# EAGLE design sensor-board (EAGLE 6.4)
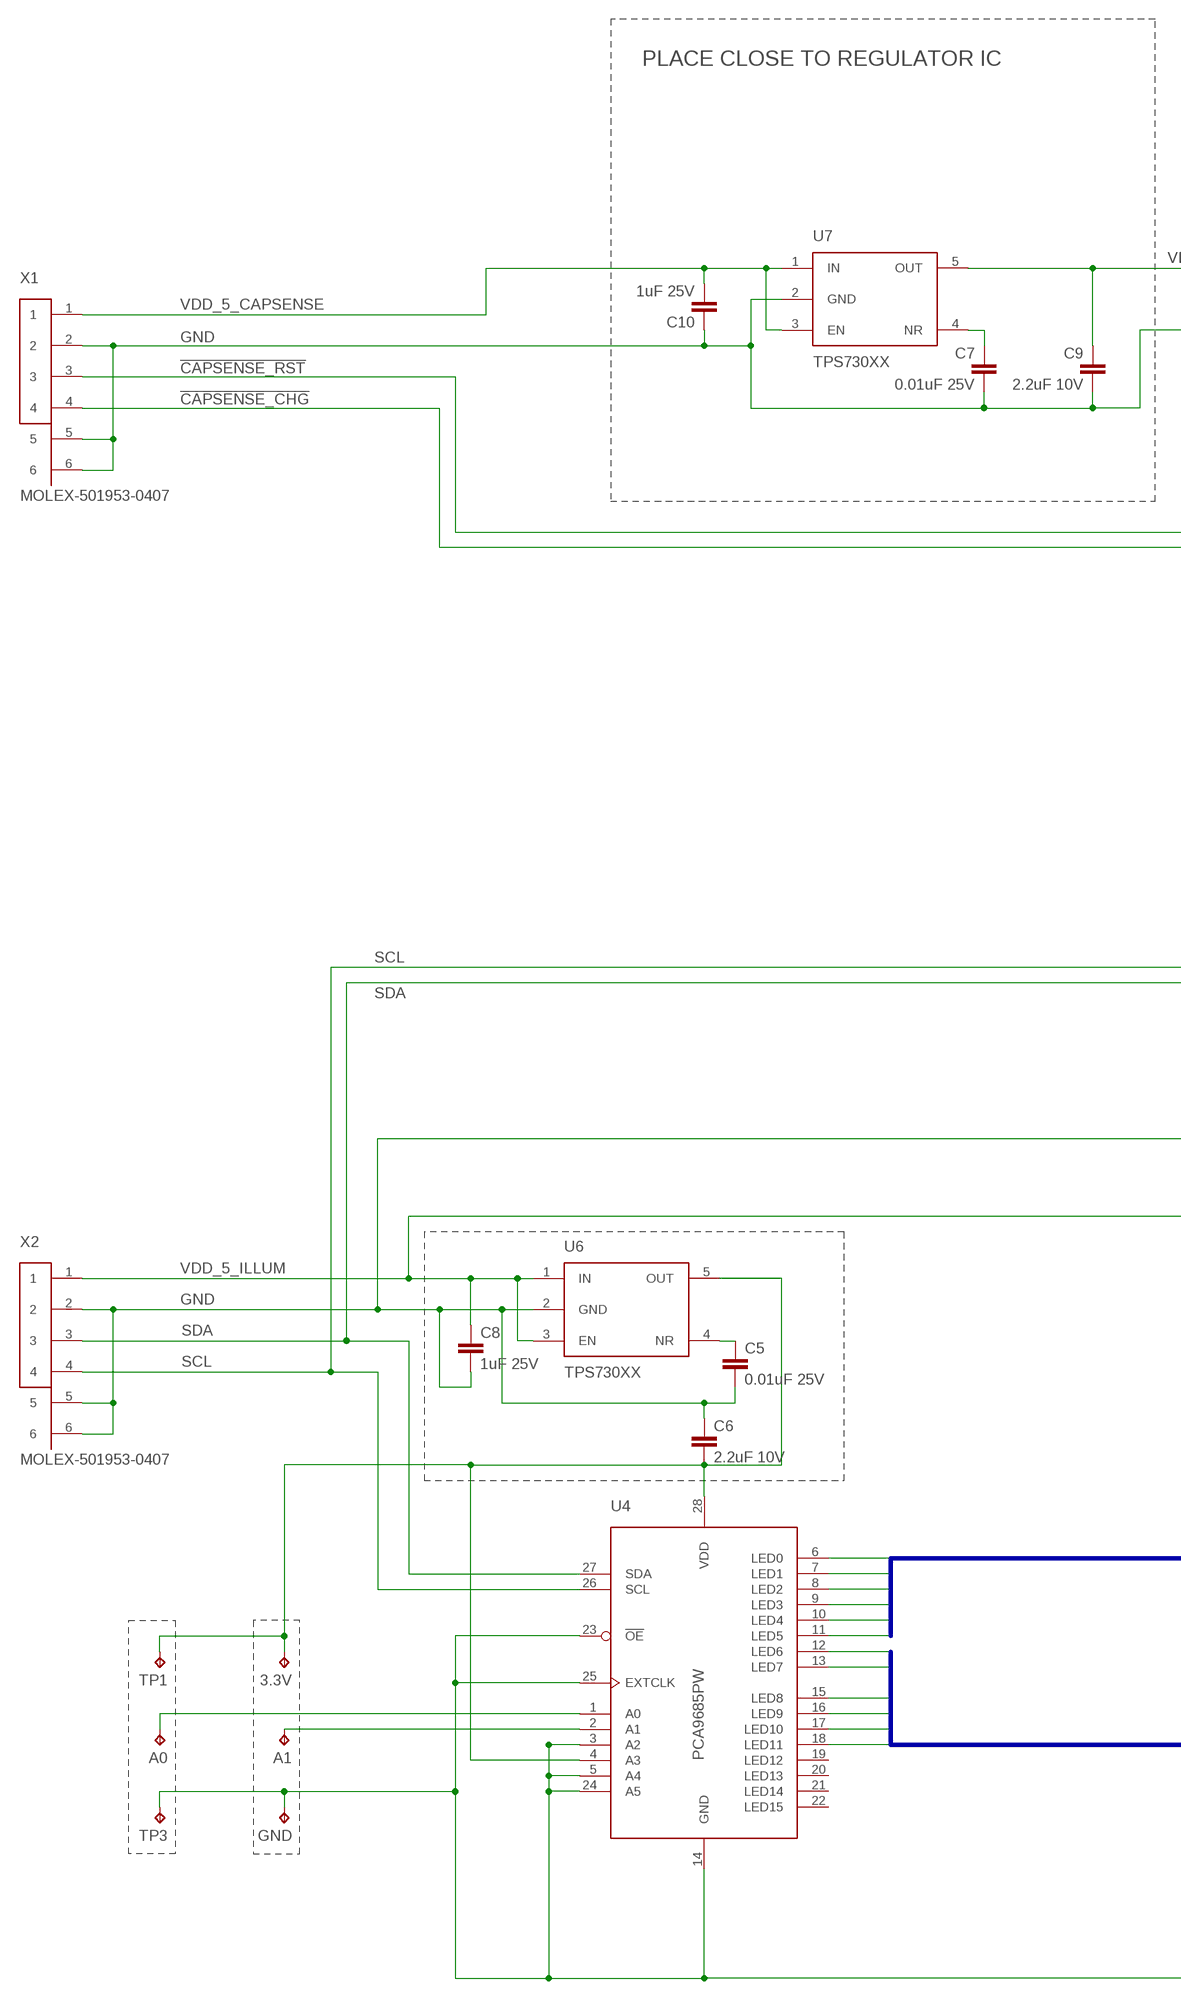
[diagram p0: schematic, sheet 1, part 1 of 2]
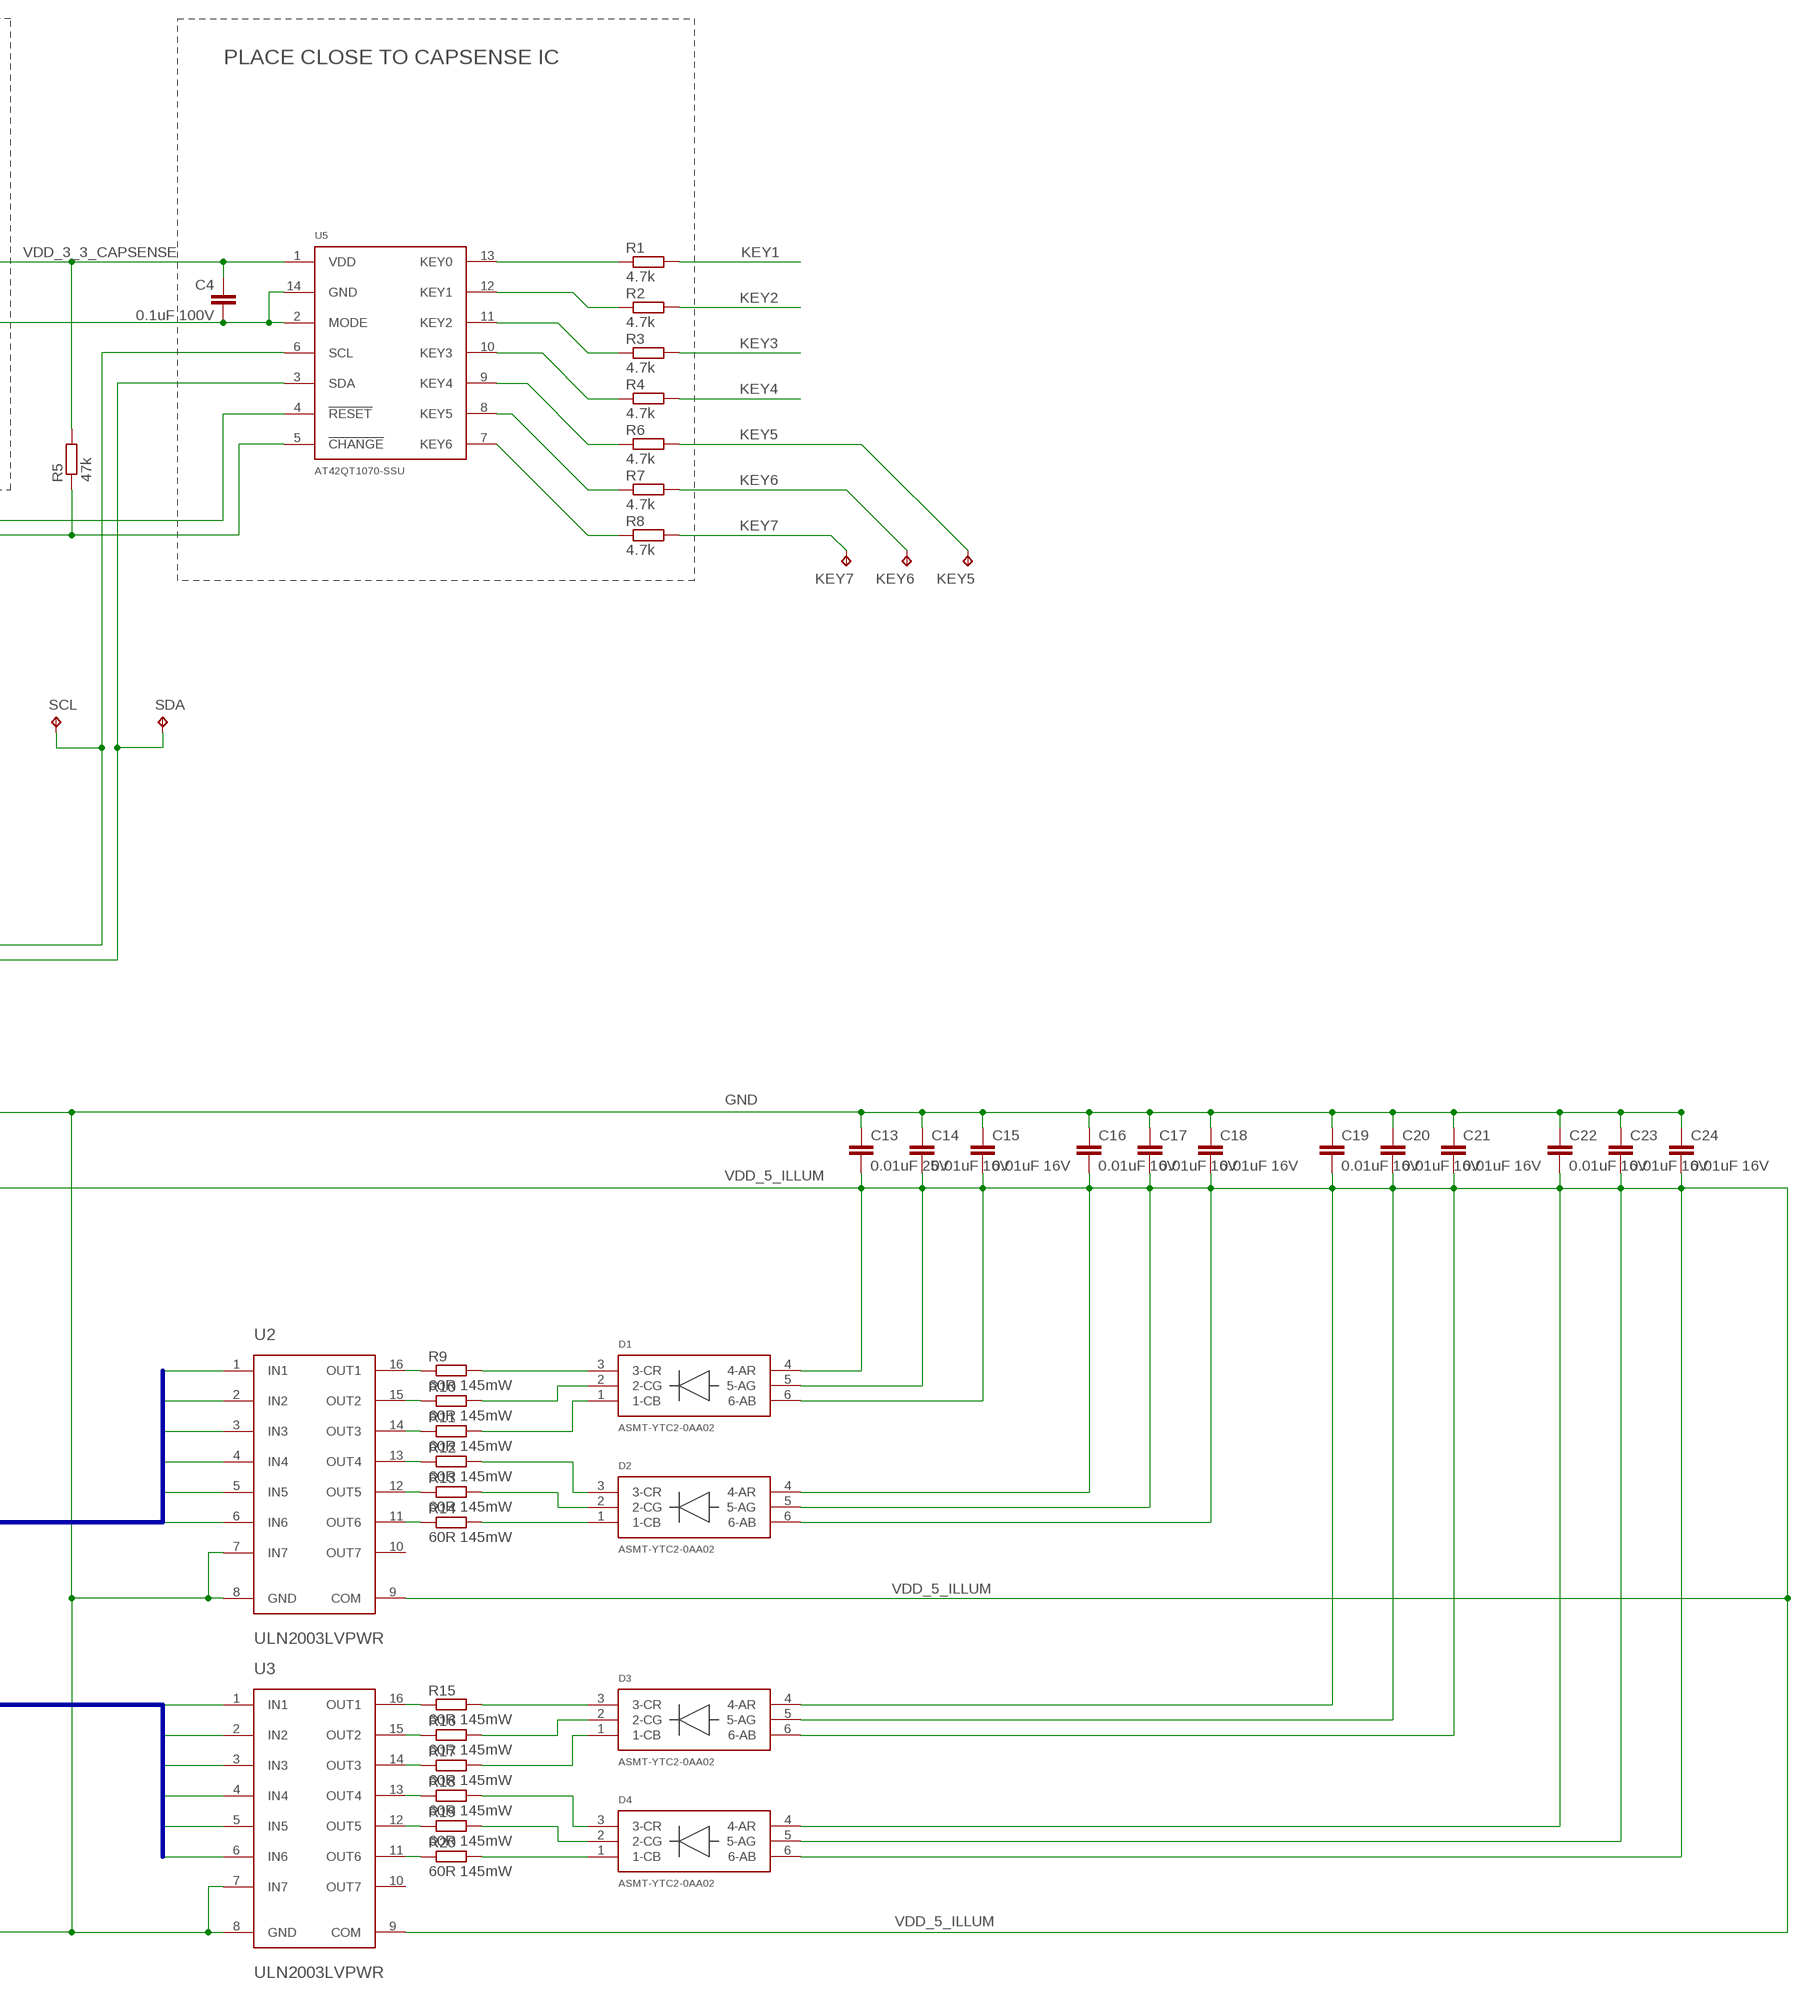
[diagram p1: schematic, sheet 1, part 2 of 2]

## Parts
3.3V  TPB1,27  [B1,27]
A0  TPB1,27  [B1,27]
A1  TPB1,27  [B1,27]
C4  0.1uF 100V  C-EUC0402K  [C0402K]
C5  0.01uF 25V  C-EUC0402K  [C0402K]
C6  2.2uF 10V  C-EUC0402K  [C0402K]
C7  0.01uF 25V  C-EUC0402K  [C0402K]
C8  1uF 25V  C-EUC0402K  [C0402K]
C9  2.2uF 10V  C-EUC0402K  [C0402K]
C10  1uF 25V  C-EUC0402K  [C0402K]
C13  0.01uF 25V  C-EUC0402K  [C0402K]
C14  0.01uF 16V  C-EUC0402K  [C0402K]
C15  0.01uF 16V  C-EUC0402K  [C0402K]
C16  0.01uF 16V  C-EUC0402K  [C0402K]
C17  0.01uF 16V  C-EUC0402K  [C0402K]
C18  0.01uF 16V  C-EUC0402K  [C0402K]
C19  0.01uF 16V  C-EUC0402K  [C0402K]
C20  0.01uF 16V  C-EUC0402K  [C0402K]
C21  0.01uF 16V  C-EUC0402K  [C0402K]
C22  0.01uF 16V  C-EUC0402K  [C0402K]
C23  0.01uF 16V  C-EUC0402K  [C0402K]
C24  0.01uF 16V  C-EUC0402K  [C0402K]
D1  ASMT-YTC2-0AA02  [ASMT-YTC2-0AA02-REV]
D2  ASMT-YTC2-0AA02  [ASMT-YTC2-0AA02-REV]
D3  ASMT-YTC2-0AA02  [ASMT-YTC2-0AA02-REV]
D4  ASMT-YTC2-0AA02  [ASMT-YTC2-0AA02-REV]
GND  TPB1,27  [B1,27]
KEY5  TPTP06R  [TP06R]
KEY6  TPTP06R  [TP06R]
KEY7  TPTP06R  [TP06R]
R1  4.7k  R-EU_NKR0402  [R0402]
R2  4.7k  R-EU_NKR0402  [R0402]
R3  4.7k  R-EU_NKR0402  [R0402]
R4  4.7k  R-EU_NKR0402  [R0402]
R5  47k  R-EU_NKR0402  [R0402]
R6  4.7k  R-EU_NKR0402  [R0402]
R7  4.7k  R-EU_NKR0402  [R0402]
R8  4.7k  R-EU_NKR0402  [R0402]
R9  60R 145mW  R-EU_NKR0603  [R0603]
R10  60R 145mW  R-EU_NKR0603  [R0603]
R11  60R 145mW  R-EU_NKR0603  [R0603]
R12  60R 145mW  R-EU_NKR0603  [R0603]
R13  60R 145mW  R-EU_NKR0603  [R0603]
R14  60R 145mW  R-EU_NKR0603  [R0603]
R15  60R 145mW  R-EU_NKR0603  [R0603]
R16  60R 145mW  R-EU_NKR0603  [R0603]
R17  60R 145mW  R-EU_NKR0603  [R0603]
R18  60R 145mW  R-EU_NKR0603  [R0603]
R19  60R 145mW  R-EU_NKR0603  [R0603]
R20  60R 145mW  R-EU_NKR0603  [R0603]
SCL  TPTP06R  [TP06R]
SDA  TPTP06R  [TP06R]
TP1  TPB1,27  [B1,27]
TP3  TPB1,27  [B1,27]
U2  ULN2003LVPWR  [TSSOP-PW-R-PDSO-G16]
U3  ULN2003LVPWR  [TSSOP-PW-R-PDSO-G16]
U4  PCA9685PW  [SOT361-1]
U5  AT42QT1070-SSU  [SO14]
U6  TPS730XX  [SOT23-5]
U7  TPS730XX  [SOT23-5]
X1  MOLEX-501953-0407  [MOLEX-501953-0407]
X2  MOLEX-501953-0407  [MOLEX-501953-0407]

## Nets
!CAPSENSE_CHG!: R5.1 U5.5(!CHANGE!) X1.4
!CAPSENSE_RST!: U5.4(!RESET!) X1.3
GND: C4.2 C5.2 C6.1 C7.2 C8.2 C9.2 C10.1 C13.1 C14.1 C15.1 C16.1 C17.1 C18.1 C19.1 C20.1 C21.1 C22.1 C23.1 C24.1 GND.TP TP3.TP U2.7(IN7) U2.8(GND) U3.7(IN7) U3.8(GND) U4.3(A2) U4.5(A4) U4.14(GND) U4.23(!OE!) U4.24(A5) U4.25(EXTCLK) U5.2(MODE) U5.14(GND) U6.2(GND) U7.2(GND) X1.2 X1.5 X1.6 X2.2 X2.5 X2.6
KEY1: R1.2
KEY2: R2.2
KEY3: R3.2
KEY4: R4.2
KEY5: KEY5.TP R6.2
KEY6: KEY6.TP R7.2
KEY7: KEY7.TP R8.2
LEDOUT_A1: U2.1(IN1) U4.6(LED0)
LEDOUT_A2: U2.2(IN2) U4.7(LED1)
LEDOUT_A3: U2.3(IN3) U4.8(LED2)
LEDOUT_A4: U2.4(IN4) U4.9(LED3)
LEDOUT_A5: U2.5(IN5) U4.10(LED4)
LEDOUT_A6: U2.6(IN6) U4.11(LED5)
LEDOUT_B1: U3.1(IN1) U4.12(LED6)
LEDOUT_B2: U3.2(IN2) U4.13(LED7)
LEDOUT_B3: U3.3(IN3) U4.15(LED8)
LEDOUT_B4: U3.4(IN4) U4.16(LED9)
LEDOUT_B5: U3.5(IN5) U4.17(LED10)
LEDOUT_B6: U3.6(IN6) U4.18(LED11)
N$1: C5.1 U6.4(NR)
N$6: A0.TP U4.1(A0)
N$7: A1.TP U4.2(A1)
N$8: C7.1 U7.4(NR)
N$10: R6.1 U5.9(KEY4)
N$11: R7.1 U5.8(KEY5)
N$12: R8.1 U5.7(KEY6)
N$15: R1.1 U5.13(KEY0)
N$16: R2.1 U5.12(KEY1)
N$17: R3.1 U5.11(KEY2)
N$18: R4.1 U5.10(KEY3)
N$31: D4.1(1-CB) R20.2
N$32: D1.1(1-CB) R11.2
N$33: D1.2(2-CG) R10.2
N$34: D3.3(3-CR) R15.2
N$35: D2.3(3-CR) R12.2
N$36: D2.2(2-CG) R13.2
N$37: R15.1 U3.16(OUT1)
N$38: R16.1 U3.15(OUT2)
N$39: D3.1(1-CB) R17.2
N$40: D3.2(2-CG) R16.2
N$41: D4.3(3-CR) R18.2
N$42: D4.2(2-CG) R19.2
N$55: R17.1 U3.14(OUT3)
N$56: R18.1 U3.13(OUT4)
N$57: R19.1 U3.12(OUT5)
N$58: R20.1 U3.11(OUT6)
N$59: D2.1(1-CB) R14.2
N$60: D1.3(3-CR) R9.2
N$61: R9.1 U2.16(OUT1)
N$62: R10.1 U2.15(OUT2)
N$63: R11.1 U2.14(OUT3)
N$64: R12.1 U2.13(OUT4)
N$65: R13.1 U2.12(OUT5)
N$66: R14.1 U2.11(OUT6)
SCL: SCL.TP U4.26(SCL) U5.6(SCL) X2.4
SDA: SDA.TP U4.27(SDA) U5.3(SDA) X2.3
VDD_3_3_CAPSENSE: C4.1 C9.1 R5.2 U5.1(VDD) U7.5(OUT)
VDD_3_3_PWMDRIVE: 3.3V.TP C6.2 TP1.TP U4.4(A3) U4.28(VDD) U6.5(OUT)
VDD_5_CAPSENSE: C10.2 U7.1(IN) U7.3(EN) X1.1
VDD_5_ILLUM: C8.1 C13.2 C14.2 C15.2 C16.2 C17.2 C18.2 C19.2 C20.2 C21.2 C22.2 C23.2 C24.2 D1.4(4-AR) D1.5(5-AG) D1.6(6-AB) D2.4(4-AR) D2.5(5-AG) D2.6(6-AB) D3.4(4-AR) D3.5(5-AG) D3.6(6-AB) D4.4(4-AR) D4.5(5-AG) D4.6(6-AB) U2.9(COM) U3.9(COM) U6.1(IN) U6.3(EN) X2.1
Unconnected: U2.10(OUT7) U3.10(OUT7) U4.19(LED12) U4.20(LED13) U4.21(LED14) U4.22(LED15)

## Buses
LEDOUT_A[1..6]
LEDOUT_B[1..6]

## Notes on the sheet
- PLACE CLOSE TO REGULATOR IC | PLACE CLOSE TO CAPSENSE IC

## Library data of the parts
3.3V A0 A1 GND KEY5-KEY7 SCL SDA TP1 TP3 = testpad:TP: Test pad
C4 = rcl:C-EU: CAPACITOR, European symbol; ELEMENT14_URL: http://sg.element14.com/jsp/search/productdetail.jsp?sku=1833861; MFR_PART: 0402YC104KAT2A
C5 C7 C13-C24 = rcl:C-EU: CAPACITOR, European symbol; ELEMENT14_URL: http://sg.element14.com/jsp/search/productdetail.jsp?sku=1692285; MFR_PART: C0402C103J3RACTU
C6 = rcl:C-EU: CAPACITOR, European symbol; ELEMENT14_URL: http://sg.element14.com/jsp/search/productdetail.jsp?sku=2118127; MFR_PART: C0402C225M8PAC TU
C8 C10 = rcl:C-EU: CAPACITOR, European symbol; ELEMENT14_URL: http://sg.element14.com/jsp/search/productdetail.jsp?sku=1844112; MFR_PART: C1005X5R1A105K050BB
C9 = rcl:C-EU: CAPACITOR, European symbol; ELEMENT14_URL: http://sg.element14.com/jsp/search/productdetail.jsp?sku=2146156; MFR_PART: C1608X7R1C105K080AC
D1-D4 = led:ASMT-YTC2-0AA02
R1-R4 R6-R8 = myrcl:R-EU_NK: RESISTOR, European symbol; ELEMENT14_URL: http://sg.element14.com/jsp/search/productdetail.jsp?sku=1768801; MFR_PART: PCF0402PR-4K7BT1
R5 = myrcl:R-EU_NK: RESISTOR, European symbol; ELEMENT14_URL: http://sg.element14.com/jsp/search/productdetail.jsp?sku=1799288; MFR_PART: RC0402JR-0747KL
R9-R20 = myrcl:R-EU_NK: RESISTOR, European symbol; ELEMENT14_URL: http://sg.element14.com/jsp/search/productdetail.jsp?sku=1894102; MFR_PART: ERJP03F62R0V
U2 U3 = led_driver:ULN2003LV
U4 = led_driver:PCA9685
U5 = touch_ctl:AT42QT1070
U6 U7 = vreg:TPS730XX
X1 X2 = connector:MOLEX-501953-0407

## Board
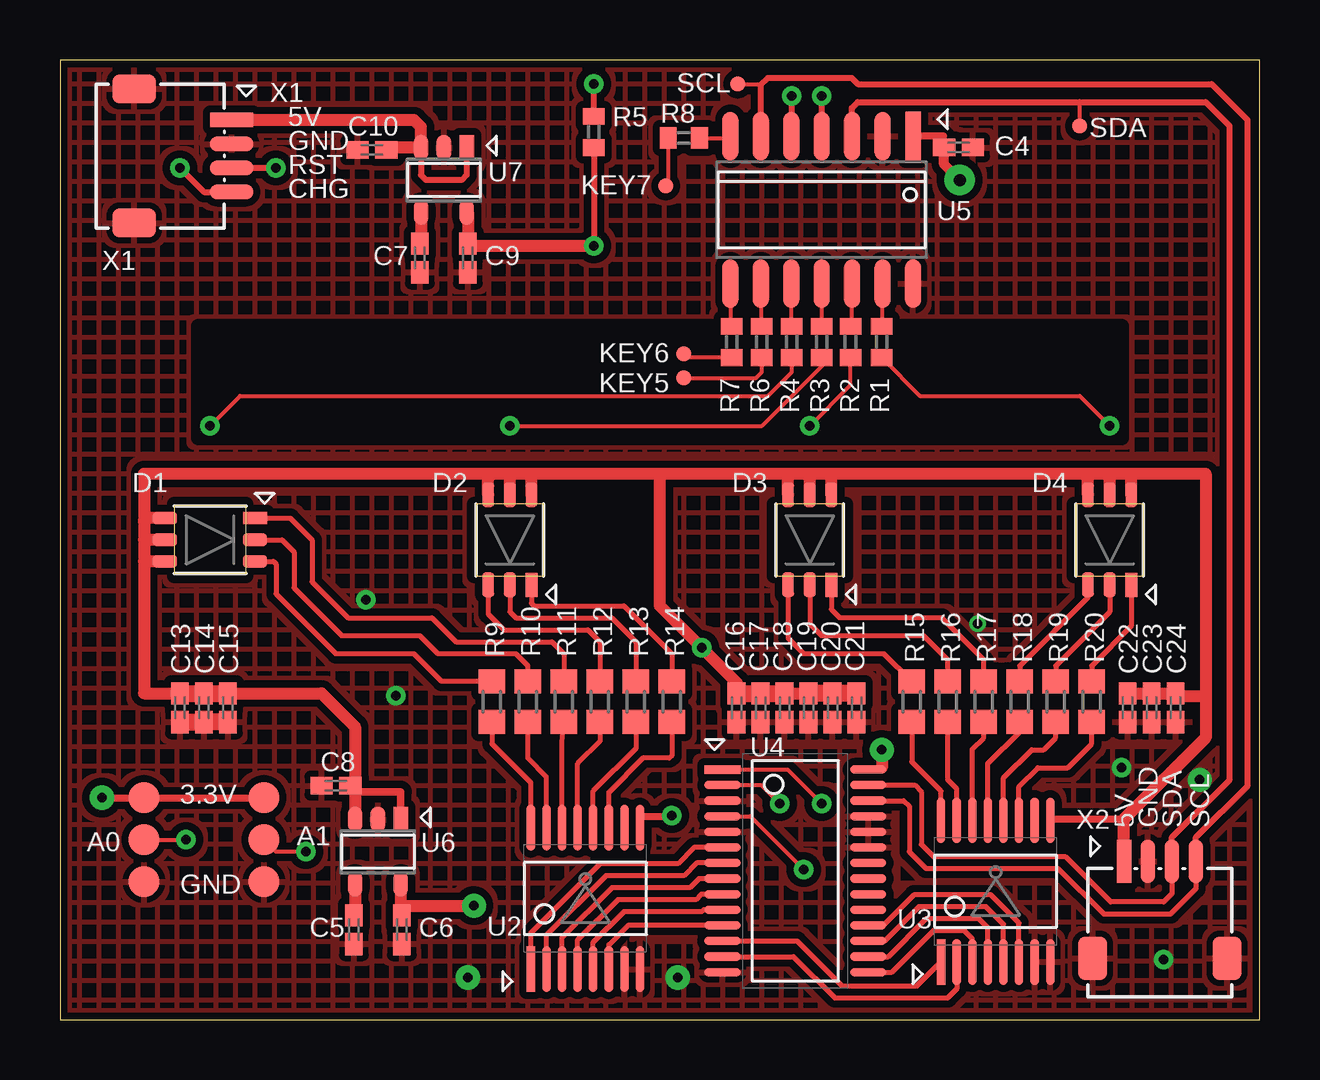
[diagram p2: board, top side]
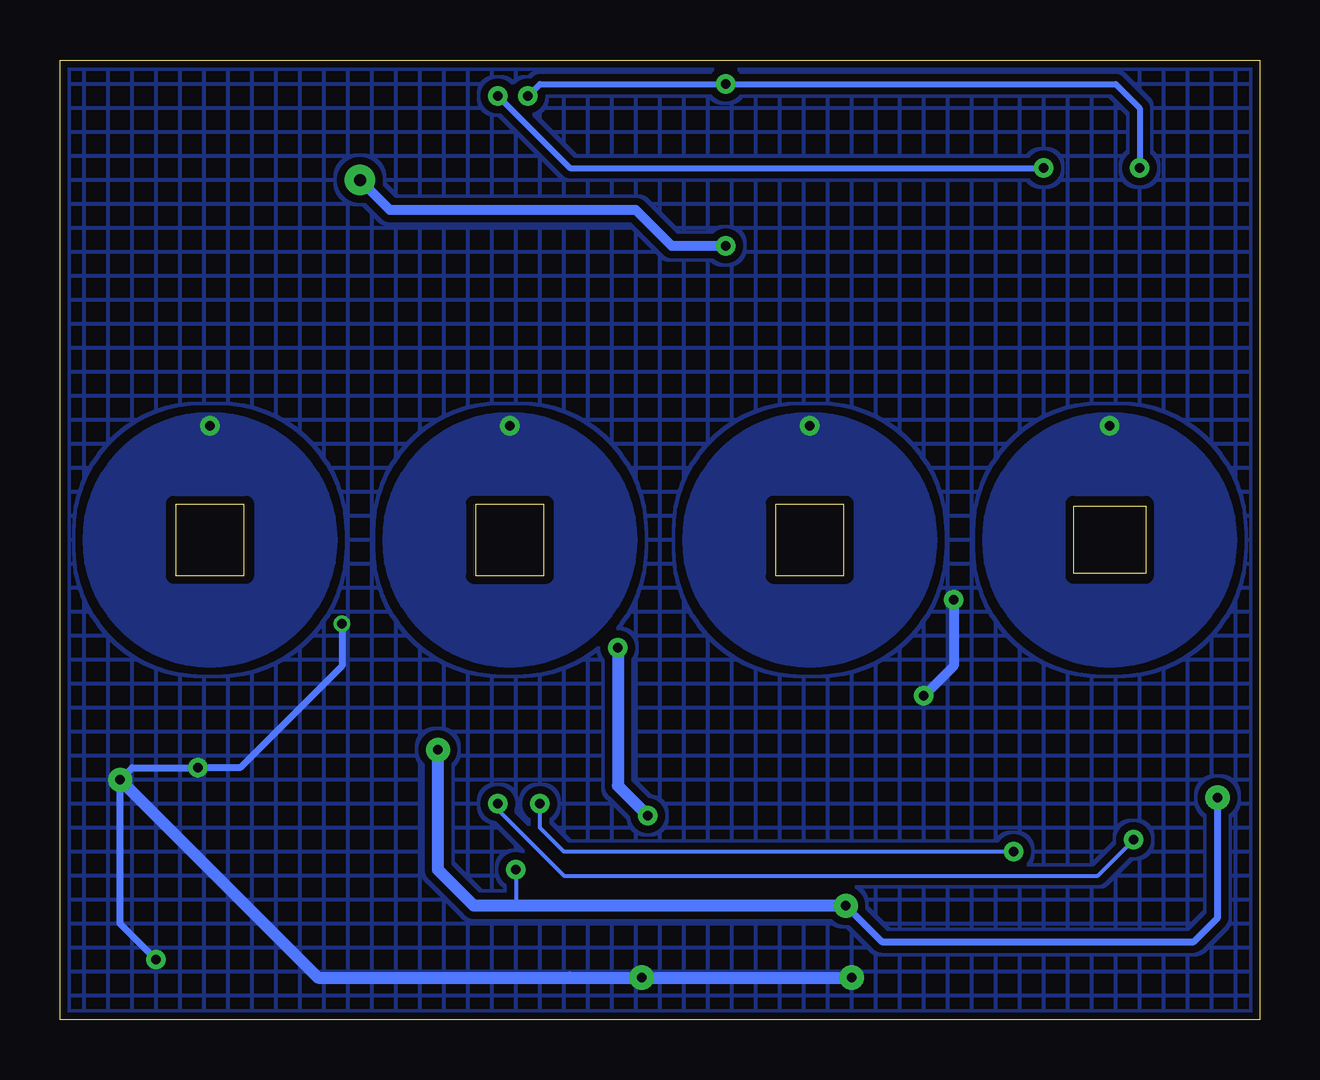
[diagram p3: board, bottom side, seen from below]

Size 50 x 40 mm. Coordinates in mm from the lower left corner, seen from the top.
Outline: 0,0 50,0 50,40 0,40 0,0
Copper layers (1*2*15*16): Top 0.035mm / dielectric 0.2mm / layer 2 0.0175mm / dielectric 1.1mm / layer 15 0.0175mm / dielectric 0.2mm / Bottom 0.035mm
Design rules "SeeedStudio_DRU_no_angle_20130527": minimum track width 6mil, minimum drill 12mil, track to track 6mil, track to pad 6mil, pad to pad 6mil, via to via 6mil, smd to smd 0mil, copper to edge 10mil, drill to drill 10mil, minimum pad ring 6mil, minimum via ring 6mil, stop-mask expansion 2mil, vias tented up to drill 25mil, thermal gap 10mil
tRestrict: area 4.8,18.5 to 7.8,21.5; area 17.2,18.5 to 20.2,21.5; area 29.8,18.5 to 32.8,21.5; area 42.2,18.5 to 45.2,21.5; area 5.8,24.2 to 44.2,28.9

### Footprints (pad centres in the part's own frame; a part is rotated, then mirrored left to right if it is on the bottom)
B1,27 = smd 1.27 x 1.27: TP 0,0
C0402K = smd 0.925 x 0.74: 1 -0.6,0; 2 0.6,0
ASMT-YTC2-0AA02-REV = smd 1 x 0.5: 1 -1.875,-0.9; 2 -1.875,0; 3 -1.875,0.9; 4 1.875,0.9; 5 1.875,0; 6 1.875,-0.9
TP06R = smd 0.6 x 0.6: TP 0,0
R0402 = smd 0.7 x 0.9: 1 -0.65,0; 2 0.65,0
R0603 = smd 1 x 1.1: 1 -0.85,0; 2 0.85,0
TSSOP-PW-R-PDSO-G16 = smd 1.9 x 0.35: 1 -2.95,2.275; 2 -2.95,1.625; 3 -2.95,0.975; 4 -2.95,0.325; 5 -2.95,-0.325; 6 -2.95,-0.975; 7 -2.95,-1.625; 8 -2.95,-2.275; 9 2.95,-2.275; 10 2.95,-1.625; 11 2.95,-0.975; 12 2.95,-0.325; 13 2.95,0.325; 14 2.95,0.975; 15 2.95,1.625; 16 2.95,2.275
SOT361-1 = smd 1.5 x 0.35: 1 -3.038,4.225; 2 -3.038,3.575; 3 -3.038,2.925; 4 -3.038,2.275; 5 -3.038,1.625; 6 -3.038,0.975; 7 -3.038,0.325; 8 -3.038,-0.325; 9 -3.038,-0.975; 10 -3.038,-1.625; 11 -3.038,-2.275; 12 -3.038,-2.925; 13 -3.038,-3.575; 14 -3.038,-4.225; 15 3.038,-4.225; 16 3.038,-3.575; 17 3.038,-2.925; 18 3.038,-2.275; 19 3.038,-1.625; 20 3.038,-0.975; 21 3.038,-0.325; 22 3.038,0.325; 23 3.038,0.975; 24 3.038,1.625; 25 3.038,2.275; 26 3.038,2.925; 27 3.038,3.575; 28 3.038,4.225
SO14 = smd 0.66 x 2.032: 1 -3.81,-3.073; 2 -2.54,-3.073; 3 -1.27,-3.073; 4 0,-3.073; 5 1.27,-3.073; 6 2.54,-3.073; 7 3.81,-3.073; 8 3.81,3.073; 9 2.54,3.073; 10 1.27,3.073; 11 0,3.073; 12 -1.27,3.073; 13 -2.54,3.073; 14 -3.81,3.073
SOT23-5 = smd 0.6 x 1.05: 1 -0.95,-1.35; 2 0,-1.35; 3 0.95,-1.35; 4 0.95,1.35; 5 -0.95,1.35
MOLEX-501953-0407 = smd 0.6 x 1.8: 1 -1.5,5.65; 2 -0.5,5.65; 3 0.5,5.65; 4 1.5,5.65 | smd 1.2 x 1.8: 5 -2.8,1.6; 6 2.8,1.6

### Placement (x,y rotation side)
3.3V  8.5,9.25 90 top
A0  3.5,7.5 90 top
A1  8.5,7.5 90 top
C4  37.45,36.35 0 top
C5  12.25,3.75 270 top
C6  14.25,3.75 90 top
C7  15,31.75 270 top
C8  11.5,9.75 180 top
C9  17,31.75 270 top
C10  13,36.25 0 top
C13  5,13 90 top
C14  6,13 90 top
C15  7,13 90 top
C16  28.2,13 90 top
C17  29.2,13 90 top
C18  30.2,13 90 top
C19  31.2,13 90 top
C20  32.2,13 90 top
C21  33.2,13 90 top
C22  44.5,13 90 top
C23  45.5,13 90 top
C24  46.5,13 90 top
D1  6.25,20 180 top
D2  18.75,20 90 top
D3  31.25,20 90 top
D4  43.75,20 90 top
GND  8.5,5.75 90 top
KEY5  26,26.75 0 top
KEY6  26,27.75 0 top
KEY7  25.25,34.75 0 top
R1  34.25,28.25 270 top
R2  32.95,28.25 270 top
R3  31.75,28.25 270 top
R4  30.5,28.25 270 top
R5  22.25,37 270 top
R6  29.25,28.25 270 top
R7  28,28.25 270 top
R8  26,36.75 180 top
R9  18,13.25 90 top
R10  19.5,13.25 90 top
R11  21,13.25 90 top
R12  22.5,13.25 90 top
R13  24,13.25 90 top
R14  25.5,13.25 90 top
R15  35.5,13.25 90 top
R16  37,13.25 90 top
R17  38.5,13.25 90 top
R18  40,13.25 90 top
R19  41.5,13.25 90 top
R20  43,13.25 90 top
SCL  28.25,39 0 top
SDA  42.5,37.25 180 top
TP1  3.5,9.25 90 top
TP3  3.5,5.75 90 top
U2  21.9,5.05 90 top
U3  39,5.35 90 top
U4  30.65,6.2 0 top
U5  31.75,33.75 180 top
U6  13.25,7 180 top
U7  16,35 180 top
X1  1.5,36 270 top
X2  45.85,0.95 0 top

### Tracks (layer width: path | path; a pad name or v marks a point on that pad's centre or on a via)
!CAPSENSE_CHG!  (via drill 0.4 pad 0.81)
  Top 0.17: U5.5 30.5,36.84
  Top 0.25: 30.5,36.84 v30.5,38.5 | v5,35.5 6,34.5 X1.4 | R5.1 v22.25,39
  Bottom 0.25: v30.5,38.5 30,39 v22.25,39 6,39 5,38 v5,35.5
!CAPSENSE_RST!  (via drill 0.4 pad 0.81)
  Top 0.25: U5.4 v31.75,38.5 | v9,35.5 X1.3
  Bottom 0.25: v31.75,38.5 28.75,35.5 v9,35.5
GND  (via drill 0.4, 0.4 pad 0.81, 0.4 pad 1, 0.4 pad 1.02)
  Top 0.7: C13.1 C14.1 C15.1
  Bottom 0.3: v46,2.5 47.5,4 v47.5,10 47,10.5 v44.25,10.5 42.5,10.5 38.25,14.75 v38.25,16.5
  Bottom 0.406: v12.75,17.5 12.75,14.75 v14,13.5
  Bottom 0.5: 28.75,1.75 v25.75,1.75 | v25.75,1.75 v17,1.75 | v47.5,10 39.25,1.75 v25.75,1.75
  pour Top (isolate 0.305, hatched): 0,40 0,0 50,0 50,40
  pour Bottom (isolate 0.305, rank 3, hatched): 0,40 50,40 50,0 0,0
KEY1  (via drill 0.4 pad 0.81)
  Top 0.17: v43.75,24.75 42.5,26 35.85,26 R1.2
  pour Bottom: 38.5,20 arc-90 43.75,25.25 arc-90 49,20 arc-90 43.75,14.75 arc-90
KEY2  (via drill 0.4 pad 0.81)
  Top 0.17: v31.25,24.75 32.95,26.45 R2.2
  pour Bottom: 26,20 arc-90 31.25,25.25 arc-90 36.5,20 arc-90 31.25,14.75 arc-90
KEY3  (via drill 0.4 pad 0.81)
  Top 0.17: v18.75,24.75 29.25,24.75 31.75,27.25 R3.2
  pour Bottom: 13.5,20 arc-90 18.75,25.25 arc-90 24,20 arc-90 18.75,14.75 arc-90
KEY4  (via drill 0.4 pad 0.81)
  Top 0.17: v6.25,24.75 7.5,26 29.5,26 30.5,27 R4.2
  pour Bottom: 1,20 arc-90 6.25,25.25 arc-90 11.5,20 arc-90 6.25,14.75 arc-90
KEY5
  Top 0.17: KEY5.TP 29,26.75 29.25,27 R6.2
KEY6
  Top 0.17: R7.2 26.15,27.6 KEY6.TP
KEY7
  Top 0.17: R8.2 25.35,34.85 KEY7.TP
LEDOUT_A1
  Top 0.2: U4.6 26.43,7.17 25.75,6.5 22.5,6.5 19.62,3.62 U2.1
LEDOUT_A2
  Top 0.2: U4.7 26.52,6.53 26,6 22.75,6 20.27,3.52 U2.2
LEDOUT_A3
  Top 0.2: U4.8 26.62,5.88 26.25,5.5 23,5.5 20.93,3.42 U2.3
LEDOUT_A4
  Top 0.2: U4.9 26.73,5.22 26.5,5 23.25,5 21.57,3.33 U2.4
LEDOUT_A5
  Top 0.2: U4.10 26.82,4.58 26.75,4.5 23.5,4.5 22.23,3.23 U2.5
LEDOUT_A6
  Top 0.2: U2.6 22.88,3.12 23.68,3.92 U4.11
LEDOUT_B1
  Top 0.2: U4.12 30.73,3.27 32.6,1.4 35.73,1.4 U3.1
LEDOUT_B2
  Top 0.2: U4.13 30.57,2.62 32.3,0.9 37,0.9 37.38,1.27 U3.2
LEDOUT_B3
  Top 0.2: U4.15 34.67,1.98 36.4,3.7 37.7,3.7 38.02,3.38 U3.3
LEDOUT_B4
  Top 0.2: U4.16 34.52,2.62 36.1,4.2 38.3,4.2 38.67,3.83 U3.4
LEDOUT_B5
  Top 0.2: U4.17 34.38,3.27 35.8,4.7 38.6,4.7 39.33,3.98 U3.5
LEDOUT_B6
  Top 0.2: U4.18 34.33,3.92 35.6,5.2 38.8,5.2 39.98,4.03 U3.6
N$1
  Top 0.5: U6.4 12.3,4.4 C5.1
N$2
  cutout Bottom: 4.75,18.25 7.75,18.25 arc90 8,18.5 8,21.5 arc90 7.75,21.75 4.75,21.75 arc90 4.5,21.5 4.5,18.5 arc90
N$3
  cutout Bottom: 17.25,21.75 20.25,21.75 arc-90 20.5,21.5 20.5,18.5 arc-90 20.25,18.25 17.25,18.25 arc-90 17,18.5 17,21.5 arc-90
N$4
  cutout Bottom: 29.75,21.75 32.75,21.75 arc-90 33,21.5 33,18.5 arc-90 32.75,18.25 29.75,18.25 arc-90 29.5,18.5 29.5,21.5 arc-90
N$5
  cutout Bottom: 42.25,18.25 45.25,18.25 arc90 45.5,18.5 45.5,21.5 arc90 45.25,21.75 42.25,21.75 arc90 42,21.5 42,18.5 arc90
N$6  (via drill 0.4 pad 0.81)
  Top 0.17: A0.TP v5.25,7.5 | U4.1 30.32,10.43 v31.75,9
  Bottom 0.17: v5.25,7.5 6.75,6 29,6 31.75,8.75 v31.75,9
N$7  (via drill 0.4 pad 0.81)
  Top 0.17: U4.2 29.23,9.78 v30,9 | v10.25,7 9,7 A1.TP
  Bottom 0.17: v10.25,7 29,7 30,8 v30,9
N$8
  Top 0.5: U7.4 15.05,32.4 C7.1
N$10
  Top 0.17: U5.9 29.21,28.94 R6.1
N$11
  Top 0.17: U5.8 27.94,28.96 R7.1
N$12
  Top 0.17: R8.1 27.87,36.75 U5.7
N$15
  Top 0.17: R1.1 34.29,28.94 U5.13
N$16
  Top 0.17: R2.1 33.02,28.97 U5.12
N$17
  Top 0.17: R3.1 U5.11
N$18
  Top 0.17: R4.1 30.48,28.92 U5.10
N$31
  Top 0.2: D4.1 44.65,16.4 43,14.75 R20.2
N$32
  Top 0.2: D1.1 9.6,20.9 10.5,20 10.5,18.25 12,16.75 15.5,16.75 16.5,15.75 20.5,15.75 21,15.25 R11.2
N$33
  Top 0.2: R10.2 19.5,14.75 19,15.25 15.75,15.25 15,16 11.75,16 9.75,18 9.75,19.5 9.25,20 D1.2
N$34
  Top 0.2: R15.2 34.35,15.25 31,15.25 30.35,15.9 D3.3
N$35
  Top 0.2: D2.3 17.85,16.9 18.5,16.25 22,16.25 22.5,15.75 R12.2
N$36
  Top 0.2: D2.2 18.75,17 19,16.75 23,16.75 24,15.75 R13.2
N$37
  Top 0.2: R15.1 35.5,10.75 36.73,9.53 U3.16
N$38
  Top 0.2: U3.15 37.38,9.62 37,10 R16.1
N$39
  Top 0.2: R17.2 38.5,15 36.75,16.75 32.5,16.75 32.15,17.1 D3.1
N$40
  Top 0.2: R16.2 37,15 36,16 31.75,16 31.25,16.5 D3.2
N$41
  Top 0.2: D4.3 42.85,17.6 40,14.75 R18.2
N$42
  Top 0.2: D4.2 43.75,17 41.5,14.75 R19.2
N$55
  Top 0.2: U3.14 38.02,11.28 38.5,11.75 R17.1
N$56
  Top 0.2: U3.13 38.67,10.68 40,12 R18.1
N$57
  Top 0.2: U3.12 39.33,10.07 40.5,11.25 41,11.25 41.5,11.75 R19.1
N$58
  Top 0.2: U3.11 39.98,9.72 40.75,10.5 42,10.5 43,11.5 R20.1
N$59
  Top 0.2: D2.1 19.65,17.35 19.75,17.25 23.5,17.25 25.5,15.25 R14.2
N$60
  Top 0.2: R9.2 15.9,14.1 14.75,15.25 11.5,15.25 9,17.75 9,19 8.9,19.1 D1.3
N$61
  Top 0.2: U2.16 19.62,9.88 18,11.5 R9.1
N$62
  Top 0.2: U2.15 20.27,10.12 19.5,10.9 R10.1
N$63
  Top 0.2: U2.14 20.93,11.57 R11.1
N$64
  Top 0.2: U2.13 21.57,10.68 22.5,11.6 R12.1
N$65
  Top 0.2: U2.12 22.23,9.53 24,11.3 R13.1
N$66
  Top 0.2: U2.11 22.88,9.47 24.3,10.9 25.4,10.9 25.5,11 R14.1
SCL
  Top 0.17: 29.21,38.96 28.25,38.96 SCL.TP
  Top 0.2: U4.26 35.17,9.12 35.4,8.9 35.4,7 36.1,6.3 41.6,6.3 43.5,4.4 46.3,4.4 47.35,5.45 X2.4
  Top 0.25: U5.6 29.21,38.96 29.5,39.25 33,39.25 33.25,39 48,39 49.5,37.5 49.5,9.75 47.35,7.6 X2.4
SDA
  Top 0.17: U5.3 33,36.84 | SDA.TP 42.5,38.25
  Top 0.2: U4.27 35.62,9.78 35.9,9.5 35.9,7.3 36.4,6.8 41.9,6.8 43.8,4.9 46,4.9 46.35,5.25 X2.3
  Top 0.25: 33,36.84 33,38 33.25,38.25 42.5,38.25 47.75,38.25 48.75,37.25 48.75,10 46.35,7.6 X2.3
VDD_3_3_CAPSENSE  (via drill 0.4 pad 0.81, 0.5 pad 1.27)
  Top 0.25: R5.2 v22.25,32.25
  Top 0.3: C4.1 36.82,36.82 U5.1
  Top 0.406: v37.5,35 36.85,35.65 C4.1
  Top 0.5: 37.5,35.02 v37.5,35 | U7.5 17,33.65 C9.1 17,32.25 v22.25,32.25
  Bottom 0.406: v22.25,32.25 24.5,32.25 26,33.75 36.25,33.75 v37.5,35
VDD_3_3_PWMDRIVE  (via drill 0.4 pad 0.81, 0.4 pad 1, 0.4 pad 1.02)
  Top 0.17: U4.4 28.77,8.47 v31,6.25
  Top 0.3: 34.25,10.5 34.17,10.43 U4.28 | v1.75,9.25 TP1.TP 3.3V.TP
  Top 0.5: U6.5 14.2,4.75 | 14.2,4.75 v17.25,4.75 | v34.25,11.25 34.25,10.5 | 14.2,4.75 14.2,4.4 C6.2
  Bottom 0.17: 30.5,4.75 31,4.75 v31,6.25
  Bottom 0.3: v17.25,4.75 15.75,3.25 2.75,3.25 1.75,4.25 v1.75,9.25
  Bottom 0.5: v17.25,4.75 31,4.75 32.75,4.75 34.25,6.25 v34.25,11.25
VDD_5_CAPSENSE
  Top 0.25: U7.3 15.05,35.2 15.25,35 16.75,35 16.95,35.2 U7.1
  Top 0.5: X1.1 14.75,37.5 15.05,37.2 U7.3 13.7,36.35 C10.2
VDD_5_ILLUM  (via drill 0.4 pad 0.81)
  Top 0.2: 24.18,8.47 U2.9
  Top 0.3: 44.35,8.35 41.33,8.35 U3.9 | 24.18,8.47 25.48,8.47 v25.5,8.5
  Top 0.305: U6.1 14.2,9.5 12.3,9.5
  Top 0.5: 4.15,20.9 D1.6 3.65,20.9 arc90 3.5,20.75 | C18.2 C19.2 | C22.2 C23.2 C24.2 46.5,13.5 47.75,13.5 | 47.75,13.5 47.75,22.75 44.75,22.75 | 47.75,13.5 47.75,11.75 44.35,8.35 X2.1 | 44.75,22.75 43.75,22.75 | 43.75,22.75 43,22.75 | 43,22.75 32.25,22.75 | 32.25,22.75 31.25,22.75 | 31.25,22.75 30.5,22.75 | 30.5,22.75 25,22.75 | 25,22.75 19.75,22.75 | 19.75,22.75 18.75,22.75 | 18.75,22.75 18,22.75 | 18,22.75 3.5,22.75 3.5,20.75 | D3.4 30.35,22.6 30.5,22.75 | D3.5 31.25,22.75 | D3.6 32.15,22.65 32.25,22.75 | D4.4 42.85,22.6 43,22.75 | D4.6 44.65,22.65 44.75,22.75 | D4.5 43.75,22.75 | D2.6 19.65,22.65 19.75,22.75 | D2.4 17.85,22.6 18,22.75 | D2.5 18.75,22.75 | 3.5,20.75 3.5,20 | 3.5,20 3.5,19.1 | D1.5 3.5,20 | D1.4 3.5,19.1 | 3.5,19.1 3.5,13.6 C13.2 | C16.2 28.2,14.05 v26.75,15.5 25,17.25 25,22.75 | C15.2 10.9,13.6 12.3,12.2 12.3,9.55 | U6.3 12.3,9.5 12.3,9.55 | 12.3,9.55 C8.1
  Top 0.7: C13.2 C14.2 C15.2 | C16.2 C17.2 C18.2 | C21.2 C20.2 C19.2
  Bottom 0.5: v26.75,15.5 26.75,9.75 v25.5,8.5

### Text on the board
tPlace: 5V | GND | RST | CHG | X1 | 5V | GND | SDA | SCL